# Altium schematic sheet C-Link.SchDoc
size A4; Author: ALTIUM GOSTBOM2.0 KEV; SheetNumber: 3; SheetTotal: 7
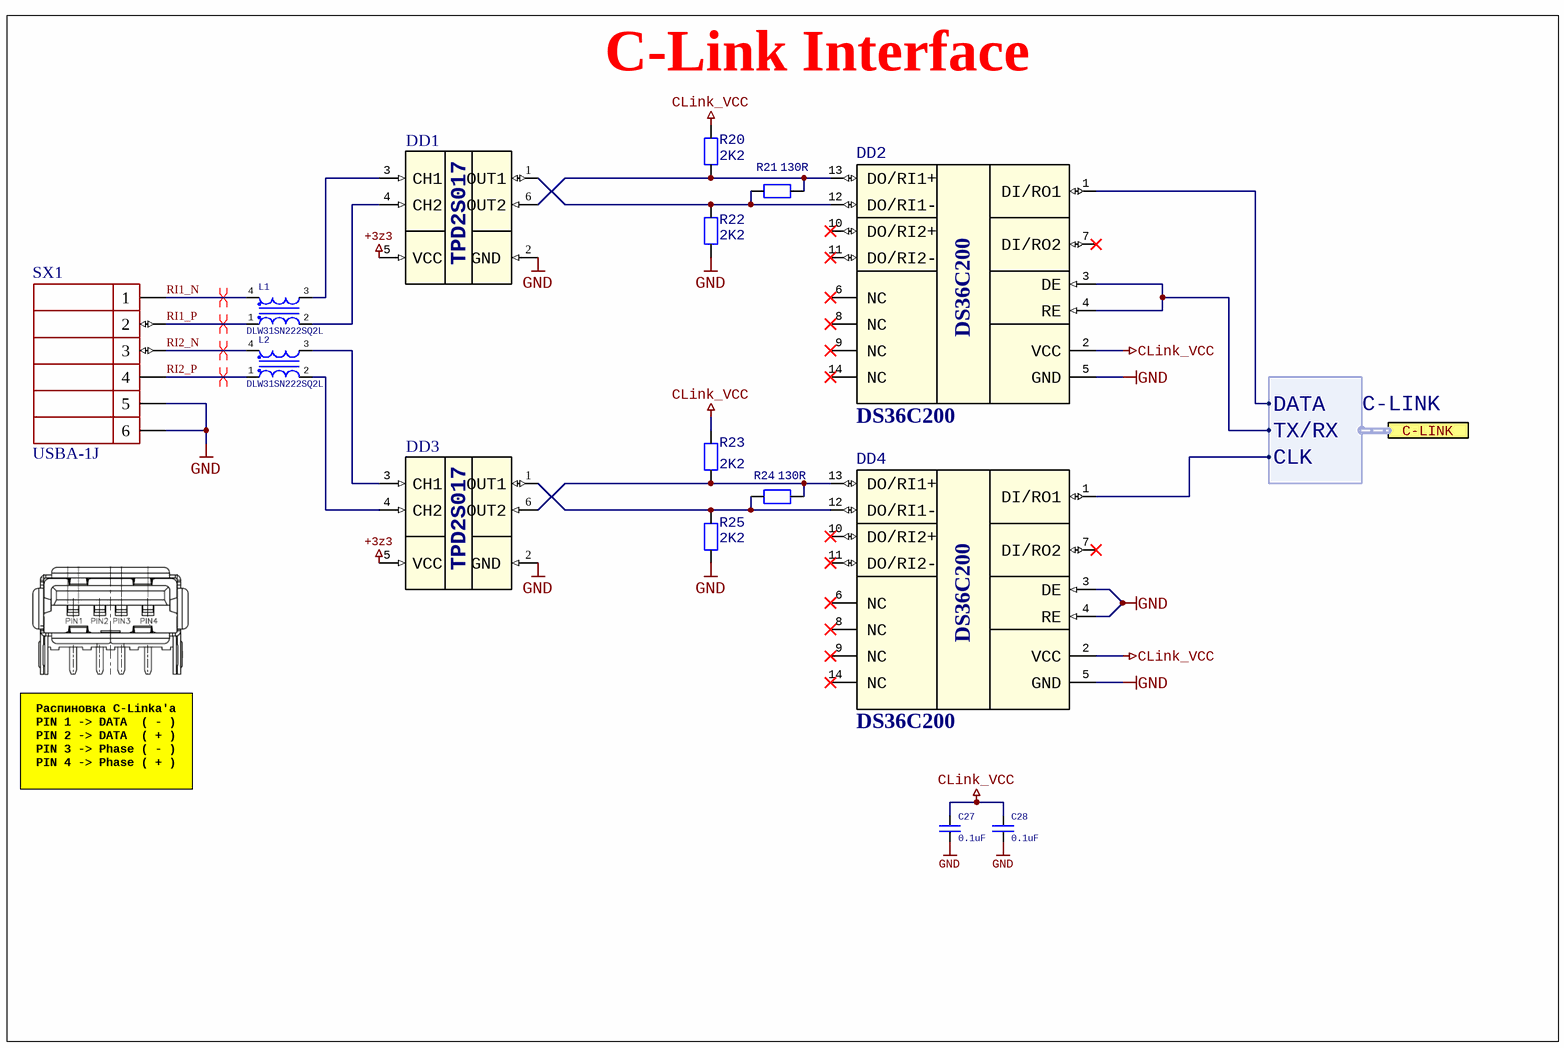
[diagram p0: C-Link.SchDoc]

## Parts
C27  0.1uF  [C_0603]
C28  0.1uF  [C_0603]
DD1  TPD2S017  [SOT-23-6]  (value not drawn)
DD2  DS36C200  [SOIC-14]
DD3  TPD2S017  [SOT-23-6]  (value not drawn)
DD4  DS36C200  [SOIC-14]
L1  DLW31SN222SQ2L  [Choke_Coil]
L2  DLW31SN222SQ2L  [Choke_Coil]
R20  2K2  [R_0603]
R21  130R  [R_0603]
R22  2K2  [R_0603]
R23  2K2  [R_0603]
R24  130R  [R_0603]
R25  2K2  [R_0603]
SX1  USBA-1J  [USB_A_(DS1095)]

## Ports
C-LINK (harness C-LINK)

## Harnesses
C-LINK: CLK, DATA, TX/RX

## Nets
+3z3: DD1.5(VCC) DD3.5(VCC)
CLink_VCC: C27.2 C28.2 DD2.2(VCC) DD4.2(VCC) R20.1 R23.1
GND: C27.1 C28.1 DD1.2(GND) DD2.5(GND) DD3.2(GND) DD4.3(DE) DD4.4(RE) DD4.5(GND) R22.2 R25.2 SX1.5 SX1.6
RI1_N: L1.4 SX1.1
RI1_P: L1.1 SX1.2
RI2_N: L2.4 SX1.3
RI2_P: L2.1 SX1.4
NetDD1_1: DD1.1(OUT1) DD2.12(DO/RI1-) R21.1 R22.1
NetDD1_3: DD1.3(CH1) L1.3
NetDD1_4: DD1.4(CH2) L1.2
NetDD1_6: DD1.6(OUT2) DD2.13(DO/RI1+) R20.2 R21.2
NetDD2_1: DD2.1(DI/RO1) ; port C-LINK.DATA
NetDD2_3: DD2.3(DE) DD2.4(RE) ; port C-LINK.TX/RX
NetDD3_1: DD3.1(OUT1) DD4.12(DO/RI1-) R24.1 R25.1
NetDD3_3: DD3.3(CH1) L2.3
NetDD3_4: DD3.4(CH2) L2.2
NetDD3_6: DD3.6(OUT2) DD4.13(DO/RI1+) R23.2 R24.2
NetDD4_1: DD4.1(DI/RO1) ; port C-LINK.CLK

Not connected (* = marked no-connect by the designer): DD2 6(NC)* 7(DI/RO2)* 8(NC)* 9(NC)* 10(DO/RI2+)* 11(DO/RI2-)* 14(NC)*; DD4 6(NC)* 7(DI/RO2)* 8(NC)* 9(NC)* 10(DO/RI2+)* 11(DO/RI2-)* 14(NC)*

## Layout directives
differential pair: RI1_N, RI1_P, RI2_N, RI2_P

## Notes on the sheet
- (near R20) С-Link Interface
- Распиновка С-Linka'a
  PIN 1 -> DATA  ( - )
  PIN 2 -> DATA  ( + )
  PIN 3 -> Phase ( - )
  PIN 4 -> Phase ( + )
- Перв. примен.
- Справ. №
- Подп. дата
- Инв. № дубл.
- Взам. инв. №
- Подп. и дата
- Изм.
- Разраб.
- Лист
- № докум.
- Подп.
- Дата
- Лит.
- Масса
- Масштаб
- Пров.
- Т.контр.
- Листов
- Инв. № подл.
- Н.контр.
- Утв.
- ALTIUM GOSTBOM2.0 KEV
- Файл:
- Копировал
- Формат А3

## Library data of the parts
C27 C28 = C: Non-polarised capacitor; ComponentLink1Description: Manufacturer Link; ComponentLink1URL: www.murata.com; ComponentLink2Description: Datasheet Link; ComponentLink2URL: http://www.murata.com/products/catalog/pdf/c02e.pdf; ValueSCH: *
L1 L2 = L_1
R20-R25 = R